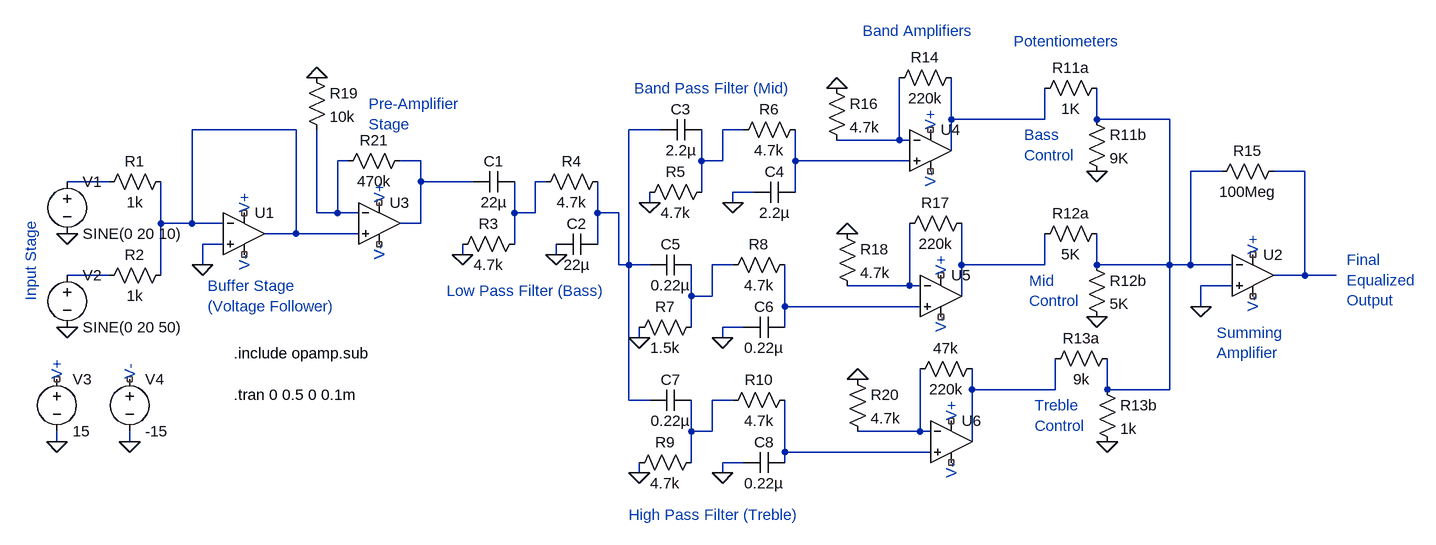
[diagram p0: schematic licpdfull.asc]
licpdfull.asc, the LTspice schematic file:
Version 4.1
SHEET 1 2036 680
WIRE 1248 -192 1248 -256
WIRE 1392 -192 1392 -240
WIRE 1392 -192 1248 -192
WIRE 1472 -192 1472 -240
WIRE 1584 -192 1472 -192
WIRE 240 -176 80 -176
WIRE 800 -176 752 -176
WIRE 928 -176 896 -176
WIRE 1168 -160 1168 -256
WIRE 1168 -160 1072 -160
WIRE 1184 -160 1168 -160
WIRE 1248 -144 1248 -192
WIRE 320 -128 304 -128
WIRE 432 -128 400 -128
WIRE 864 -128 864 -176
WIRE 896 -128 896 -176
WIRE 896 -128 864 -128
WIRE 1008 -128 1008 -176
WIRE 1184 -128 1008 -128
WIRE 1664 -112 1616 -112
WIRE 1792 -112 1744 -112
WIRE -48 -96 -112 -96
WIRE 432 -96 432 -128
WIRE 512 -96 432 -96
WIRE 624 -96 608 -96
WIRE 864 -80 864 -128
WIRE 944 -80 912 -80
WIRE 1008 -80 1008 -128
WIRE 784 -64 784 -80
WIRE 912 -64 912 -80
WIRE 272 -48 272 -176
WIRE 304 -48 304 -128
WIRE 304 -48 272 -48
WIRE 336 -48 304 -48
WIRE 576 -48 576 -96
WIRE 608 -48 608 -96
WIRE 608 -48 576 -48
WIRE 704 -48 704 -96
WIRE 736 -48 704 -48
WIRE 32 -32 32 -96
WIRE 80 -32 80 -176
WIRE 80 -32 32 -32
WIRE 128 -32 80 -32
WIRE 432 -32 432 -96
WIRE 432 -32 400 -32
WIRE 240 -16 240 -176
WIRE 240 -16 192 -16
WIRE 336 -16 240 -16
WIRE 128 0 96 0
WIRE 576 0 576 -48
WIRE 704 0 704 -48
WIRE 496 16 496 0
WIRE 640 16 640 0
WIRE 96 32 96 0
WIRE 736 32 736 -48
WIRE 752 32 752 -176
WIRE 752 32 736 32
WIRE 784 32 752 32
WIRE 912 32 880 32
WIRE 1264 32 1264 -32
WIRE 1392 32 1392 -16
WIRE 1392 32 1264 32
WIRE 1472 32 1472 -16
WIRE 1584 32 1584 -192
WIRE 1584 32 1472 32
WIRE 1616 32 1616 -112
WIRE 1616 32 1584 32
WIRE 1680 32 1616 32
WIRE -48 48 -112 48
WIRE 32 48 32 -32
WIRE 1792 48 1792 -112
WIRE 1792 48 1744 48
WIRE 1840 48 1792 48
WIRE 1184 64 1184 -32
WIRE 1184 64 1088 64
WIRE 1200 64 1184 64
WIRE 1680 64 1632 64
WIRE 848 80 848 32
WIRE 880 80 880 32
WIRE 880 80 848 80
WIRE 1264 80 1264 32
WIRE 992 96 992 32
WIRE 1200 96 992 96
WIRE 1632 96 1632 64
WIRE 848 128 848 80
WIRE 928 128 896 128
WIRE 992 128 992 96
WIRE 768 144 768 128
WIRE 896 144 896 128
WIRE 1280 224 1280 192
WIRE 1408 224 1408 176
WIRE 1408 224 1280 224
WIRE 1488 224 1488 176
WIRE 1584 224 1584 32
WIRE 1584 224 1488 224
WIRE 752 240 752 32
WIRE 784 240 752 240
WIRE 912 240 880 240
WIRE 848 288 848 240
WIRE 880 288 880 240
WIRE 880 288 848 288
WIRE 1200 288 1200 192
WIRE 1200 288 1104 288
WIRE 1216 288 1200 288
WIRE -128 304 -128 288
WIRE -16 304 -16 288
WIRE 1280 304 1280 224
WIRE 992 320 992 240
WIRE 1216 320 992 320
WIRE 848 336 848 288
WIRE 928 336 896 336
WIRE 992 336 992 320
WIRE 768 352 768 336
WIRE 896 352 896 336
FLAG 496 16 0
FLAG 784 -64 0
FLAG 912 -64 0
FLAG 768 144 0
FLAG 896 144 0
FLAG 768 352 0
FLAG 896 352 0
FLAG 1632 96 0
FLAG -112 -16 0
FLAG -112 128 0
FLAG -128 304 0
FLAG -16 304 0
FLAG 640 16 0
FLAG 96 32 0
FLAG 1072 -240 0
FLAG 1088 -16 0
FLAG 1104 208 0
FLAG 272 -256 0
FLAG 1472 -112 0
FLAG 1488 304 0
FLAG 1472 112 0
SYMBOL voltage -112 -112 R0
WINDOW 123 0 0 Left 0
WINDOW 39 0 0 Left 0
SYMATTR InstName V1
SYMATTR Value SINE(0 20 10)
SYMBOL voltage -112 32 R0
WINDOW 123 0 0 Left 0
WINDOW 39 0 0 Left 0
SYMATTR InstName V2
SYMATTR Value SINE(0 20 50)
SYMBOL res 48 -112 R90
WINDOW 0 0 56 VBottom 2
WINDOW 3 32 56 VTop 2
SYMATTR InstName R1
SYMATTR Value 1k
SYMBOL res 48 32 R90
WINDOW 0 0 56 VBottom 2
WINDOW 3 32 56 VTop 2
SYMATTR InstName R2
SYMATTR Value 1k
SYMBOL cap 576 -112 R90
WINDOW 0 0 32 VBottom 2
WINDOW 3 32 32 VTop 2
SYMATTR InstName C1
SYMATTR Value 22µ
SYMBOL res 592 -16 R90
WINDOW 0 0 56 VBottom 2
WINDOW 3 32 56 VTop 2
SYMATTR InstName R3
SYMATTR Value 4.7k
SYMBOL cap 864 -192 R90
WINDOW 0 0 32 VBottom 2
WINDOW 3 32 32 VTop 2
SYMATTR InstName C3
SYMATTR Value 2.2µ
SYMBOL cap 1008 -96 R90
WINDOW 0 0 32 VBottom 2
WINDOW 3 32 32 VTop 2
SYMATTR InstName C4
SYMATTR Value 2.2µ
SYMBOL res 880 -96 R90
WINDOW 0 0 56 VBottom 2
WINDOW 3 32 56 VTop 2
SYMATTR InstName R5
SYMATTR Value 4.7k
SYMBOL res 1024 -192 R90
WINDOW 0 0 56 VBottom 2
WINDOW 3 32 56 VTop 2
SYMATTR InstName R6
SYMATTR Value 4.7k
SYMBOL cap 848 16 R90
WINDOW 0 0 32 VBottom 2
WINDOW 3 32 32 VTop 2
SYMATTR InstName C5
SYMATTR Value 0.22µ
SYMBOL cap 992 112 R90
WINDOW 0 0 32 VBottom 2
WINDOW 3 32 32 VTop 2
SYMATTR InstName C6
SYMATTR Value 0.22µ
SYMBOL res 864 112 R90
WINDOW 0 0 56 VBottom 2
WINDOW 3 32 56 VTop 2
SYMATTR InstName R7
SYMATTR Value 1.5k
SYMBOL res 1008 16 R90
WINDOW 0 0 56 VBottom 2
WINDOW 3 32 56 VTop 2
SYMATTR InstName R8
SYMATTR Value 4.7k
SYMBOL cap 848 224 R90
WINDOW 0 0 32 VBottom 2
WINDOW 3 32 32 VTop 2
SYMATTR InstName C7
SYMATTR Value 0.22µ
SYMBOL cap 992 320 R90
WINDOW 0 0 32 VBottom 2
WINDOW 3 32 32 VTop 2
SYMATTR InstName C8
SYMATTR Value 0.22µ
SYMBOL res 864 320 R90
WINDOW 0 0 56 VBottom 2
WINDOW 3 32 56 VTop 2
SYMATTR InstName R9
SYMATTR Value 4.7k
SYMBOL res 1008 224 R90
WINDOW 0 0 56 VBottom 2
WINDOW 3 32 56 VTop 2
SYMATTR InstName R10
SYMATTR Value 4.7k
SYMBOL OpAmps\\UniversalOpAmp2 160 -16 R0
SYMATTR InstName U1
SYMBOL OpAmps\\UniversalOpAmp2 1712 48 R0
SYMATTR InstName U2
SYMBOL res 1760 -128 R90
WINDOW 0 0 56 VBottom 2
WINDOW 3 32 56 VTop 2
SYMATTR InstName R15
SYMATTR Value 100Meg
SYMATTR SpiceLine tol=1 pwr=0.1
SYMBOL voltage -128 192 R0
WINDOW 123 0 0 Left 0
WINDOW 39 0 0 Left 0
SYMATTR InstName V3
SYMATTR Value 15
SYMBOL voltage -16 192 R0
WINDOW 123 0 0 Left 0
WINDOW 39 0 0 Left 0
SYMATTR InstName V4
SYMATTR Value -15
SYMBOL res 720 -112 R90
WINDOW 0 0 56 VBottom 2
WINDOW 3 32 56 VTop 2
SYMATTR InstName R4
SYMATTR Value 4.7k
SYMBOL cap 704 -16 R90
WINDOW 0 0 32 VBottom 2
WINDOW 3 32 32 VTop 2
SYMATTR InstName C2
SYMATTR Value 22µ
SYMBOL OpAmps\\UniversalOpAmp2 368 -32 R0
SYMATTR InstName U3
SYMBOL OpAmps\\UniversalOpAmp2 1216 -144 R0
SYMATTR InstName U4
SYMBOL res 1264 -272 R90
WINDOW 0 0 56 VBottom 2
WINDOW 3 32 56 VTop 2
SYMATTR InstName R14
SYMATTR Value 220k
SYMBOL res 1056 -256 R0
SYMATTR InstName R16
SYMATTR Value 4.7k
SYMBOL OpAmps\\UniversalOpAmp2 1232 80 R0
SYMATTR InstName U5
SYMBOL res 1280 -48 R90
WINDOW 0 0 56 VBottom 2
WINDOW 3 32 56 VTop 2
SYMATTR InstName R17
SYMATTR Value 220k
SYMBOL res 1072 -32 R0
SYMATTR InstName R18
SYMATTR Value 4.7k
SYMBOL OpAmps\\UniversalOpAmp2 1248 304 R0
SYMATTR InstName U6
SYMBOL res 1296 176 R90
WINDOW 0 0 56 VBottom 2
WINDOW 3 32 56 VTop 2
SYMATTR InstName 47k
SYMATTR Value 220k
SYMBOL res 1088 192 R0
SYMATTR InstName R20
SYMATTR Value 4.7k
SYMBOL res 416 -144 R90
WINDOW 0 0 56 VBottom 2
WINDOW 3 32 56 VTop 2
SYMATTR InstName R21
SYMATTR Value 470k
SYMBOL res 256 -272 R0
SYMATTR InstName R19
SYMATTR Value 10k
SYMBOL res 1488 -256 R90
WINDOW 0 0 56 VBottom 2
WINDOW 3 32 56 VTop 2
SYMATTR InstName R11a
SYMATTR Value 1K
SYMBOL res 1488 -32 R90
WINDOW 0 0 56 VBottom 2
WINDOW 3 32 56 VTop 2
SYMATTR InstName R12a
SYMATTR Value 5K
SYMBOL res 1504 160 R90
WINDOW 0 0 56 VBottom 2
WINDOW 3 32 56 VTop 2
SYMATTR InstName R13a
SYMATTR Value 9k
SYMBOL res 1456 -208 R0
SYMATTR InstName R11b
SYMATTR Value 9K
SYMBOL res 1456 16 R0
SYMATTR InstName R12b
SYMATTR Value 5K
SYMBOL res 1472 208 R0
SYMATTR InstName R13b
SYMATTR Value 1k
TEXT 144 232 Left 2 !.tran 0 0.5 0 0.1m
TEXT 144 168 Left 2 !.include opamp.sub
TEXT -128 208 VLeft 2 ;V+
TEXT -16 208 VLeft 2 ;V-
TEXT 160 16 VRight 2 ;V-
TEXT 160 -48 VLeft 2 ;V+
TEXT 1712 80 VRight 2 ;V-
TEXT 1712 16 VLeft 2 ;V+
TEXT 368 -64 VLeft 2 ;V+
TEXT 368 0 VRight 2 ;V-
TEXT 1216 -176 VLeft 2 ;V+
TEXT 368 0 VRight 2 ;V-
TEXT 1216 -112 VRight 2 ;V-
TEXT 1232 48 VLeft 2 ;V+
TEXT 1232 112 VRight 2 ;V-
TEXT 1248 272 VLeft 2 ;V+
TEXT 1248 336 VRight 2 ;V-
TEXT -168 88 VLeft 2 ;Input Stage
TEXT 104 64 Left 2 ;Buffer Stage \n(Voltage Follower)
TEXT 352 -216 Left 2 ;Pre-Amplifier\nStage
TEXT 472 72 Left 2 ;Low Pass Filter (Bass)
TEXT 760 -240 Left 2 ;Band Pass Filter (Mid)
TEXT 752 416 Left 2 ;High Pass Filter (Treble)
TEXT 1112 -328 Left 2 ;Band Amplifiers
TEXT 1344 -312 Left 2 ;Potentiometers
TEXT 1360 -168 Left 2 ;Bass\nControl
TEXT 1368 56 Left 2 ;Mid\nControl
TEXT 1376 248 Left 2 ;Treble\nControl
TEXT 1656 136 Left 2 ;Summing\nAmplifier
TEXT 1856 24 Left 2 ;Final \nEqualized\nOutput

The netlist it stands for:
* licpdfull.asc
V1 N011 0 SINE(0 20 10)
V2 N015 0 SINE(0 20 50)
R1 N003 N011 1k
R2 N003 N015 1k
C1 N012 N008 22µ
R3 N012 0 4.7k
C3 N005 N004 2.2µ
C4 N009 0 2.2µ
R5 N005 0 4.7k
R6 N009 N005 4.7k
C5 N013 N004 0.22µ
C6 N017 0 0.22µ
R7 N013 0 1.5k
R8 N017 N013 4.7k
C7 N019 N004 0.22µ
C8 N021 0 0.22µ
R9 N019 0 4.7k
R10 N021 N019 4.7k
X§U1 0 N003 NC_01 NC_02 N003 level2 Avol=1Meg GBW=10Meg Slew=10Meg Ilimit=25m Rail=0 Vos=0 En=0 Enk=0 In=0 Ink=0 Rin=500Meg  ; pins In+ In- V+ V- OUT
X§U2 0 N002 NC_03 NC_04 N010 level2 Avol=1Meg GBW=10Meg Slew=10Meg Ilimit=25m Rail=0 Vos=0 En=0 Enk=0 In=0 Ink=0 Rin=500Meg  ; pins In+ In- V+ V- OUT
R15 N010 N002 100Meg tol=1 pwr=0.1
V3 NC_05 0 15
V4 NC_06 0 -15
R4 N004 N012 4.7k
C2 N004 0 22µ
X§U3 N003 N007 NC_07 NC_08 N008 level2 Avol=1Meg GBW=10Meg Slew=10Meg Ilimit=25m Rail=0 Vos=0 En=0 Enk=0 In=0 Ink=0 Rin=500Meg  ; pins In+ In- V+ V- OUT
X§U4 N009 N006 NC_09 NC_10 N001 level2 Avol=1Meg GBW=10Meg Slew=10Meg Ilimit=25m Rail=0 Vos=0 En=0 Enk=0 In=0 Ink=0 Rin=500Meg  ; pins In+ In- V+ V- OUT
R14 N001 N006 220k
R16 0 N006 4.7k
X§U5 N017 N016 NC_11 NC_12 N014 level2 Avol=1Meg GBW=10Meg Slew=10Meg Ilimit=25m Rail=0 Vos=0 En=0 Enk=0 In=0 Ink=0 Rin=500Meg  ; pins In+ In- V+ V- OUT
R17 N014 N016 220k
R18 0 N016 4.7k
X§U6 N021 N020 NC_13 NC_14 N018 level2 Avol=1Meg GBW=10Meg Slew=10Meg Ilimit=25m Rail=0 Vos=0 En=0 Enk=0 In=0 Ink=0 Rin=500Meg  ; pins In+ In- V+ V- OUT
R§47k N018 N020 220k
R20 0 N020 4.7k
R21 N008 N007 470k
R19 0 N007 10k
R11a N002 N001 1K
R12a N002 N014 5K
R13a N002 N018 9k
R11b N002 0 9K
R12b N002 0 5K
R13b N002 0 1k
.tran 0 0.5 0 0.1m
.include opamp.sub
* V+
* V-
* V-
* V+
* V-
* V+
* V+
* V-
* V+
* V-
* V-
* V+
* V-
* V+
* V-
* Input Stage
* Buffer Stage
* (Voltage Follower)
* Pre-Amplifier
* Stage
* Low Pass Filter (Bass)
* Band Pass Filter (Mid)
* High Pass Filter (Treble)
* Band Amplifiers
* Potentiometers
* Bass
* Control
* Mid
* Control
* Treble
* Control
* Summing
* Amplifier
* Final
* Equalized
* Output
.lib UniversalOpAmp2.lib
.backanno
.end